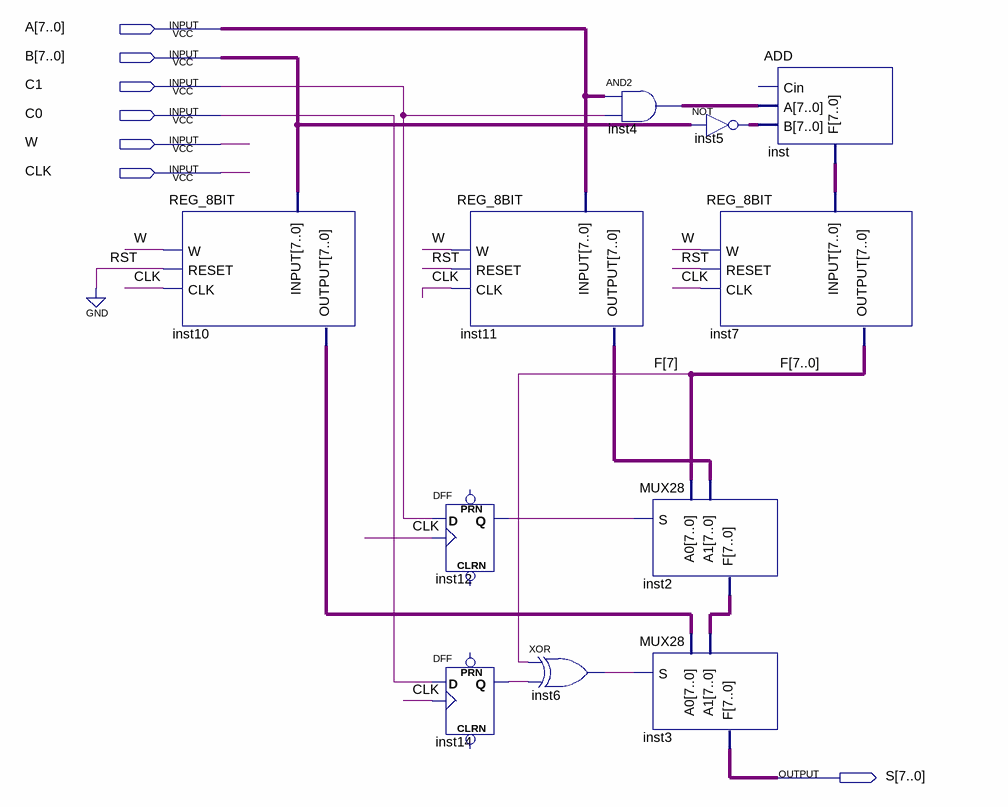
[diagram p0: schematic sheet]
// Quartus schematic ABS_MIN_MAX.bdf as structural Verilog: 11 symbols, 7 pins
module ABS_MIN_MAX (
  input  [7:0] A,
  input  [7:0] B,
  input  C1,
  input  C0,
  input  W,
  input  CLK,
  output [7:0] S
);

  wire inst6_out, inst12_q, inst14_q;
  wire [7:0] F, inst2_f, inst4_out, inst5_out, inst10_output, inst11_output, inst_f;

  REG_8BIT inst10 (.W(W), .INPUT(B), .RESET(1'b0), .CLK(CLK), .OUTPUT(inst10_output));
  DFF inst12 (.CLK(CLK), .D(C1), .Q(inst12_q));  // open: CLRN, PRN
  DFF inst14 (.CLK(CLK), .D(C0), .Q(inst14_q));  // open: CLRN, PRN
  REG_8BIT inst11 (.W(W), .INPUT(A), .RESET(1'b0), .CLK(CLK), .OUTPUT(inst11_output));
  xor inst6 (inst6_out, F[7], inst14_q);
  assign inst4_out = A & {8{C1}};  // AND2 inst4, 8 bits wide
  MUX28 inst2 (.S(inst12_q), .A0(F), .A1(inst11_output), .F(inst2_f));
  MUX28 inst3 (.S(inst6_out), .A0(inst10_output), .A1(inst2_f), .F(S));
  assign inst5_out = ~B;  // NOT inst5, 8 bits wide
  REG_8BIT inst7 (.W(W), .INPUT(inst_f), .RESET(1'b0), .CLK(CLK), .OUTPUT(F));
  ADD inst (.A(inst4_out), .B(inst5_out), .F(inst_f));  // open: Cin
endmodule
